# EasyEDA Pro project ESP32-DevKitC(立创EDA专业版导入可直接打样).epro

# Schematic SCH_ESP32
Create Date: 2023-04-07; Page Name: P1; Project Name: RY-ESP32-DevKitC; Schematic Name: SCH_ESP32; Update Date: 2023-05-24; Company: https://rymcu.com; Page Size: A4; Version: V1.0
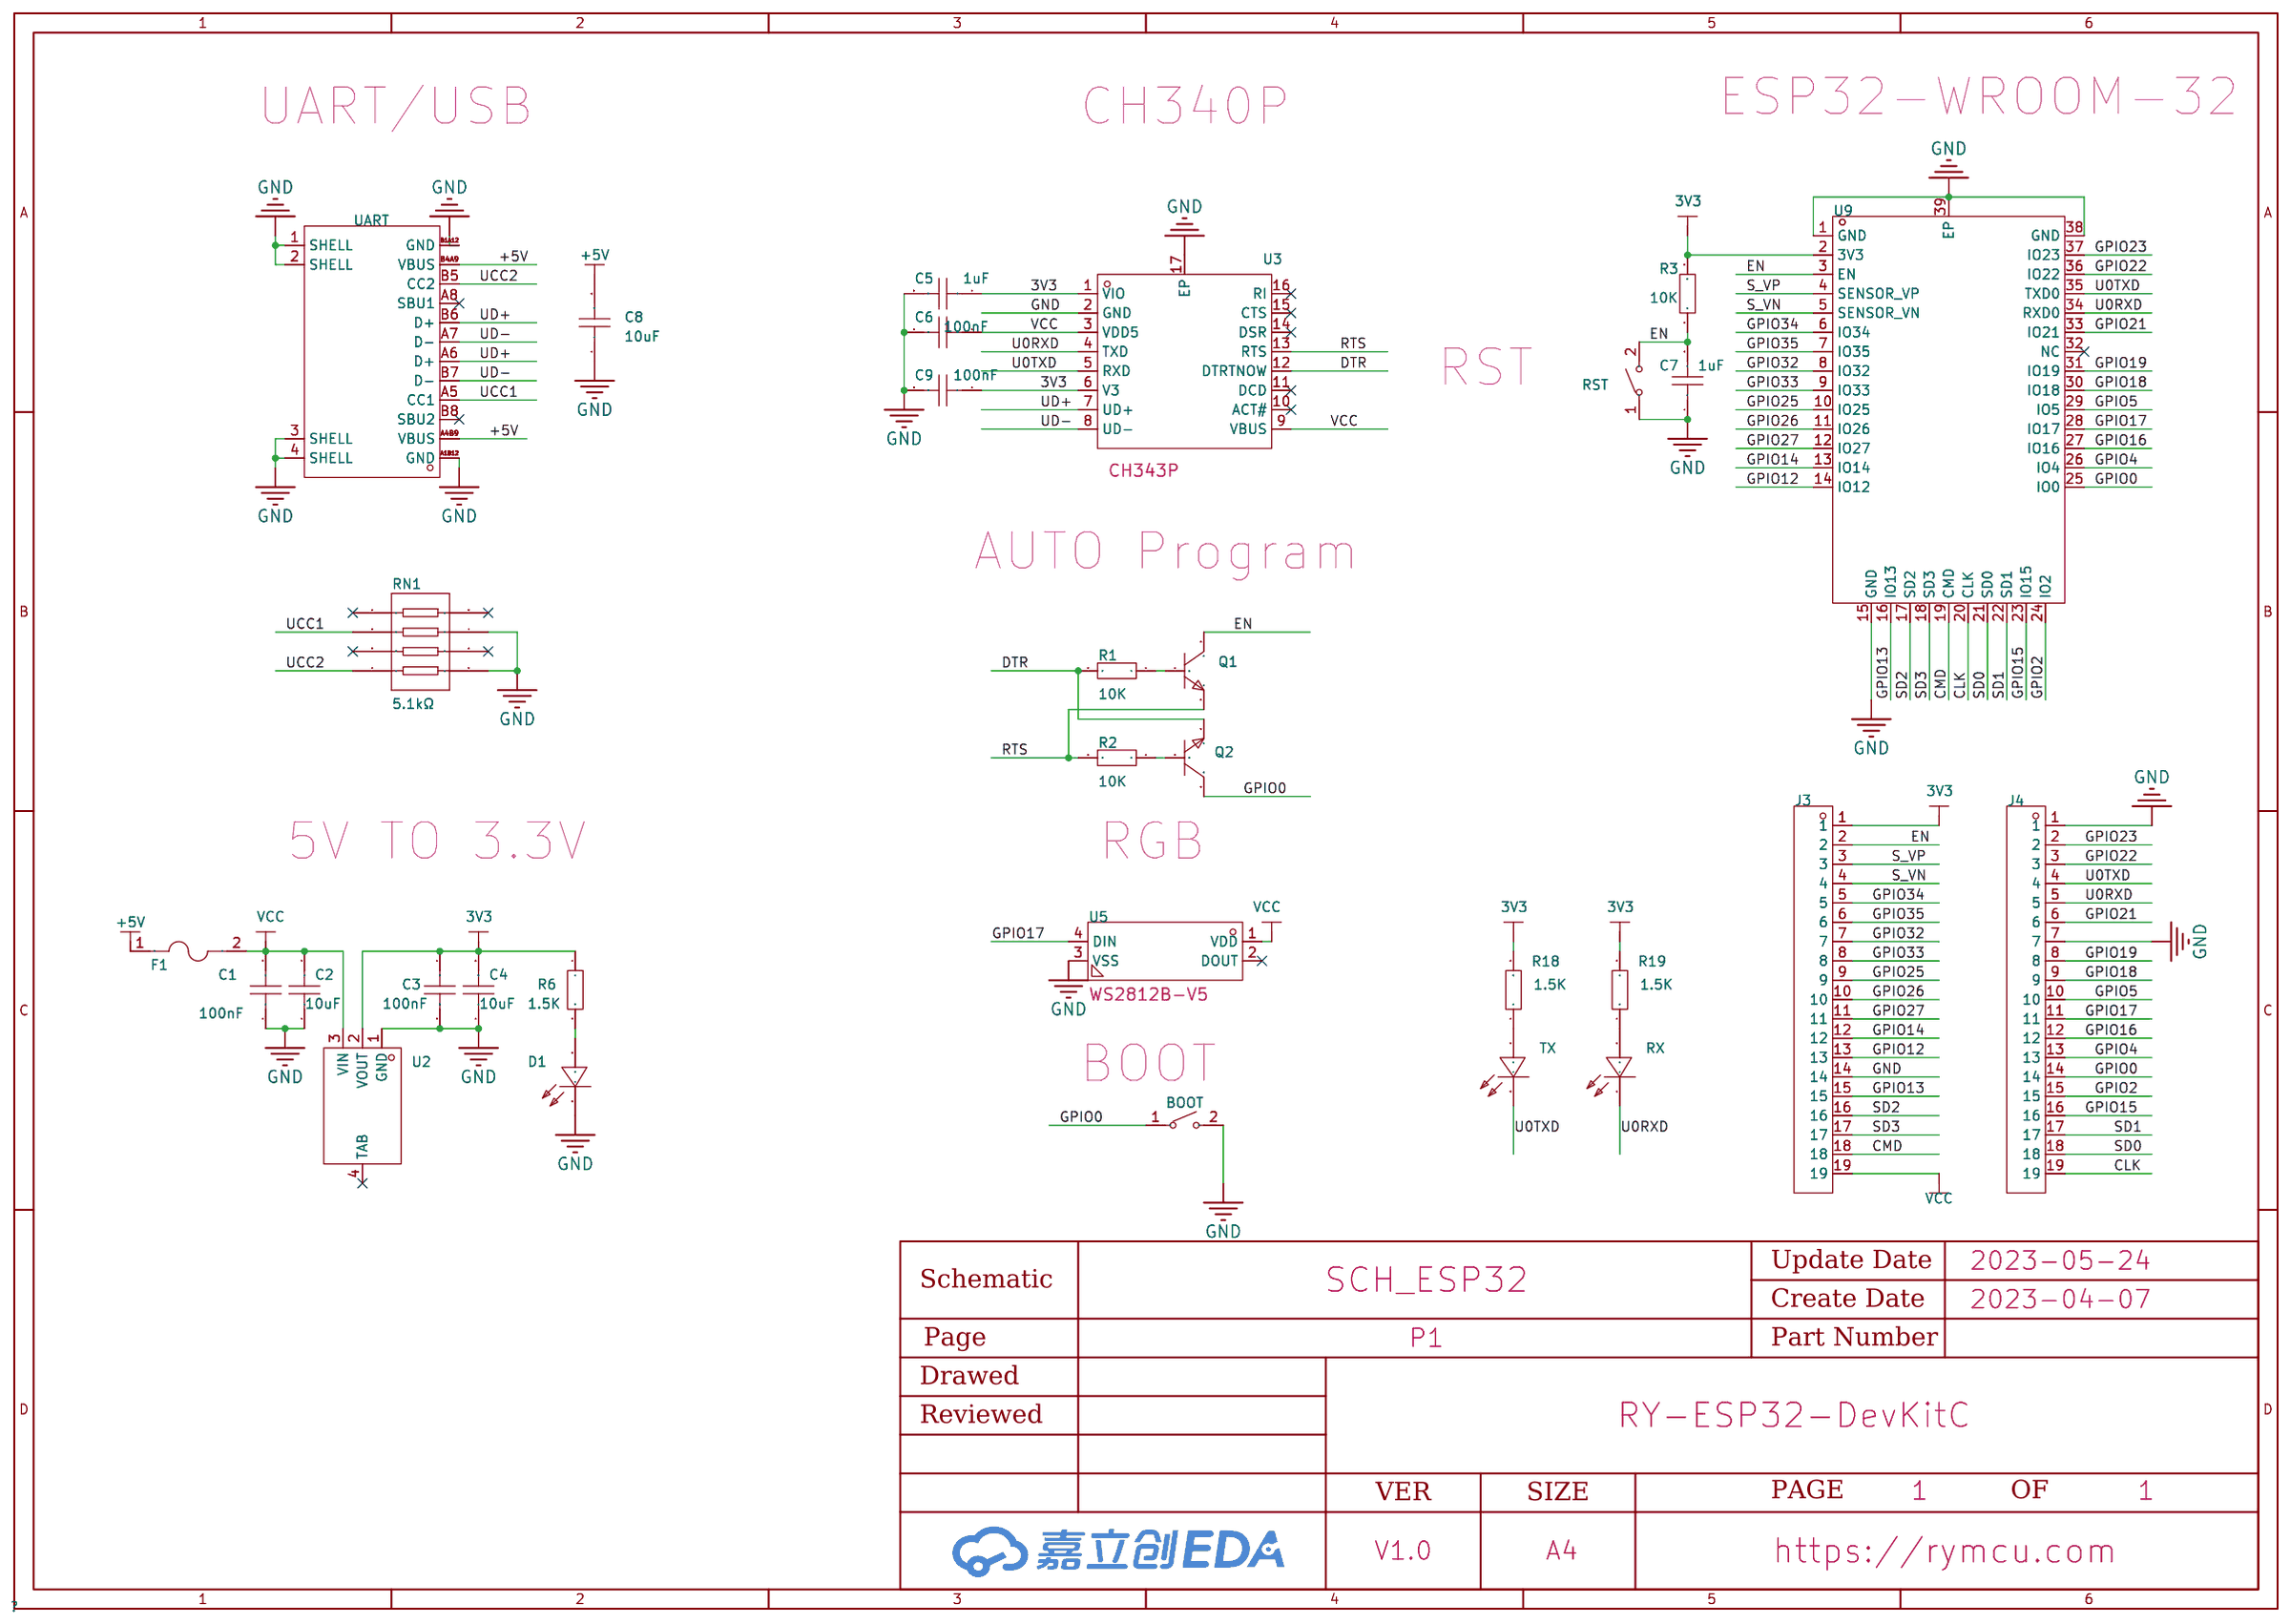
[diagram p0: schematic sheet]

## Parts
BOOT  TS-1088R-02526  [SW-SMD_L3.9-W3.0-P4.45]
C1  100nF  [C0603]
C2  10uF  [C0805]
C3  100nF  [C0603]
C4  10uF  [C0805]
C5  1uF  [C0603]
C6  100nF  [C0603]
C7  1uF  [C0603]
C8  10uF  [C0805]
C9  100nF  [C0603]
D1  NCD0603R3  [LED0603-R-RD_RED]
F1  -  [F0805]
J3  2.54-1*19P反弯针  [DIP19]
J4  2.54-1*19P反弯针  [DIP19]
Q1  L8050QLT1G  [SOT-23-3_L2.9-W1.3-P1.90-LS2.4-BR]
Q2  L8050QLT1G  [SOT-23-3_L2.9-W1.3-P1.90-LS2.4-BR]
R1  10K  [R0603]
R2  10K  [R0603]
R3  10K  [R0603]
R6  1.5K  [R0603]
R18  1.5K  [R0603]
R19  1.5K  [R0603]
RN1  5.1kΩ  [RES-ARRAY-SMD_0603-8P-L3.2-W1.6-BL]
RST  TS-1088R-02526  [SW-SMD_L3.9-W3.0-P4.45]
RX  NCD0603R3  [LED0603-R-RD_RED]
TX  NCD0603R3  [LED0603-R-RD_RED]
U2  -  [SOT-223-3_L6.5-W3.4-P2.30-LS7.0-BR]
U3  CH343P  [TQFN-16_L3.0-W3.0-P0.50-BL-EP1.7]
U5  WS2812B-V5  [LED-SMD_4P-L5.0-W5.0-TL_WS2812B-B]
U9  ESP32-WROOM-32  [WIFIM-SMD_ESP-WROOM-32]
UART  -  [USB-C-SMD_G-SWITCH_GT-USB-7010EN]

## Library data of the parts
BOOT RST = TS-1088R-02526: 触点电流:50mA;额定电压(DC):12V;电路结构:单刀单掷;安装方式:立贴;按钮形状:圆形按钮;带灯:-;开关长度:3.9mm;开关宽度:2.93mm;开关高度:2.5mm;; LCSC Part Name: 贴片无柱小龟轻触开关 260GF; Supplier Part: C455281; Manufacturer: XUNPU(讯普); Supplier Footprint: SMD,3x4x2.5mm; JLCPCB Part Class: Extended Part; Datasheet: https://atta.szlcsc.com/upload/public/pdf/source/20191118/C455281_EC5379764BC1462550DF64BBBFEA9579.pdf; Supplier: LCSC; Contact Current: 50mA; Voltage Rating (DC): 12V; Circuit: 单刀单掷; Mounting Style: 立贴; Actuator Style: 圆形按钮; Switch Length: 3.9mm; Switch Width: 2.93mm; Switch Height: 2.5mm
C1 C3 C5-C7 C9 = CC0603KRX7R9BB104: 容值:100nF;精度:±10%;额定电压:50V;材质(温度系数):X7R;; LCSC Part Name: 100nF ±10% 50V; Supplier Part: C14663; Manufacturer: YAGEO(国巨); Supplier Footprint: 0603; JLCPCB Part Class: Basic Part; Datasheet: https://atta.szlcsc.com/upload/public/pdf/source/20170116/1484561234239.pdf; Supplier: LCSC; Tolerance: ±10%; Voltage Rated: 50V; Temperature Coefficient: X7R
C2 C4 C8 = CC0805FRNPO9BN330: 容值:33pF;精度:±1pF;额定电压:50V;材质(温度系数):NP0;; LCSC Part Name: 33pF ±1pF 50V; Supplier Part: C541516; Manufacturer: YAGEO(国巨); Supplier Footprint: 0805; JLCPCB Part Class: Extended Part; Datasheet: https://atta.szlcsc.com/upload/public/pdf/source/20200615/C541516_87B4F5CEA473EFDDBB2B4786DAFFF3AA.pdf; Supplier: LCSC; Tolerance: ±1pF; Voltage Rated: 50V; Temperature Coefficient: NP0
D1 RX TX = NCD0603R3: 尺寸1.6x0.8x0.8；IF=20ma：1.6~2.6v，620~640nm,51~150mcd金线，光强高，功耗低，可靠性好，寿命长; LCSC Part Name: 红色;贴片LED;0603红灯;; Supplier Part: C3151730; Manufacturer: 国星光电; Supplier Footprint: 0603; JLCPCB Part Class: Extended Part; Datasheet: https://atta.szlcsc.com/upload/public/pdf/source/20220704/CBFF28C1847A97213A75929E60B7DDE7.pdf; Supplier: LCSC
F1 = ASMD0805-075: 最大电压:6V;最大电流:40A;保持电流:750mA;跳闸电流:1.5A;消耗功率:600mW;初始态阻值(最小值):90mΩ;跳断后阻值(最大值):385mΩ;最大动作时间:200ms;工作温度:-40~+85;; LCSC Part Name: 0.75A 自恢复; Supplier Part: C135330; Manufacturer: JDTfuse集电通; Supplier Footprint: 0805; JLCPCB Part Class: Extended Part; Datasheet: https://atta.szlcsc.com/upload/public/pdf/source/20171014/C135330_15079756464341038401.pdf; Supplier: LCSC; Operating Voltage (Max): 6V; Current Rating (Max): 40A; Hold Current: 750mA; Trip Current: 1.5A; Power Dissipation: 600mW; Resistance - Initial (Ri) (Min): 90mΩ; Resistance - Post Trip (R1) (Max): 385mΩ; Maximum Time to Trip: 200ms; Operating Temperature: -40~+85
J3 J4 = DIP19: 间距:2.54mm;总PIN位数:19;排数:1;插针结构:1x19P;行距:-;安装类型:弯插;圆针/方针:方针;额定电流:3A;额定电压:-;配合针长度:6mm;塑高:-;端接针长度:-;触头材质:黄铜;触头镀层:金;工作温度范围:-55℃~+105℃;颜色:黑色;; LCSC Part Name: 2.54mm 1x19P 弯插 方针; Supplier Part: C247840; Manufacturer: BOOMELE(博穆精密); Supplier Footprint: 插件,P=2.54mm; JLCPCB Part Class: 扩展库; Datasheet: https://atta.szlcsc.com/upload/public/pdf/source/20190322/C247840_B568C66E1694212B25CC3EB4B4A6845C.pdf; Supplier: LCSC; Pitch: 2.54mm; Number of Pins: 19; Number of Rows: 1; Pin Structure: 1x19P; Mounting Type: 弯插; Circluar Pins/Square Pins: 方针; Current Rating (Max): 3A; Length of Mating Pin: 6mm; Contact Material: 黄铜; Contact Plating: 金; Operating Temperature Range: -55℃~+105℃; Color: 黑色
Q1 Q2 = L8050QLT1G: 集电极电流(Ic):800mA;集射极击穿电压(Vceo):25V;功率(Pd):225mW;晶体管类型:NPN;; Supplier Part: C49581; Manufacturer: LRC(乐山无线电); Supplier Footprint: SOT-23(SOT-23-3); JLCPCB Part Class: 扩展库; Datasheet: https://atta.szlcsc.com/upload/public/pdf/source/20150518/1457707314424.pdf; Supplier: LCSC; Collector Current (Ic): 800mA; Collector-Emitter Breakdown Voltage (Vceo): 25V; Power Dissipation (Pd): 225mW; Transistor Type: NPN
R1-R3 R6 R18 R19 = TR0603B10K0P0525Z: 电阻类型:薄膜电阻;阻值:10kΩ;精度:±0.1%;功率:100mW;温度系数:±25ppm/;最大工作电压:75V;工作温度范围:-55~+155;; LCSC Part Name: 10kΩ ±0.1% 100mW; Supplier Part: C188363; Manufacturer: EVER OHMS(天二科技); Supplier Footprint: 0603; JLCPCB Part Class: Extended Part; Datasheet: https://atta.szlcsc.com/upload/public/pdf/source/20190415/C188363_433BF05B6FB8F7A0F5F35A3E4390C55A.pdf; Supplier: LCSC; Type: 薄膜电阻; Tolerance: ±0.1%; Power(Watts): 100mW; Temperature Coefficient: ±25ppm/; Overload Voltage (Max): 75V; Operating Temperature Range: -55~+155
RN1 = 4D03WGJ0512T5E: 阻值:5.1kΩ;精度:±5%;单个元件功率:62.5mW;温度系数:±200ppm/;电阻器数:4;引脚数:8;; LCSC Part Name: 5.1kΩ ±5% 0603x4; Supplier Part: C12028; Manufacturer: UNI-ROYAL(厚声); Supplier Footprint: 0603x4; JLCPCB Part Class: Extended Part; Datasheet: https://atta.szlcsc.com/upload/public/pdf/source/20170615/1497510926628.pdf; Supplier: LCSC; Tolerance: ±5%; Power(Watts): 62.5mW; Temperature Coefficient: ±200ppm/; Number of Resistors: 4; Number of Pins: 8
U2 = AMS1117-3.3: 输出类型:固定;输出极性:正;输出通道数:1;最大输入电压:18V;输出电压:3.3V;压差:1.4V@(1A);输出电流:800mA;电源纹波抑制比(PRSS):-;; LCSC Part Name: Vin=18V Vout=3.3V 800mA; Supplier Part: C351784; Manufacturer: PUOLOP(迪浦); Supplier Footprint: SOT-223; JLCPCB Part Class: Extended Part; Datasheet: https://atta.szlcsc.com/upload/public/pdf/source/20210915/EA806799CEEC3F52E0A4FA8303A508AC.pdf; Supplier: LCSC; Output Type: 固定; Output Polarity: 正; Number of Outputs: 1; Maximum Input Voltage: 18V; Output Voltage: 3.3V; Dropout Voltage: 1.4V@(1A); Output Current: 800mA
U3 = CH343P: 类型:-;协议类别:-;驱动器/接收器数:-;数据速率:-;; Supplier Part: C2846043; Manufacturer: WCH(南京沁恒); Supplier Footprint: QFN-16; JLCPCB Part Class: 扩展库; Datasheet: https://atta.szlcsc.com/upload/public/pdf/source/20211010/C2846043_7FA705E1F14A2906F6A2AFA45FA28209.pdf; Supplier: LCSC
U5 = WS2812B-V5: Supplier Part: C691873; Supplier Footprint: SMD,5x5mm; Supplier: LCSC
U9 = ESP32-WROOM-32: WiFi+双模蓝牙 双核CPU 网口 顶配MCU 低功耗蓝牙 ESP32系列ESP-WROOM-32模组/ESP-32S 4MB; Supplier Part: C95209; Manufacturer: ESPRESSIF(乐鑫); JLCPCB Part Class: 扩展库; Datasheet: https://atta.szlcsc.com/upload/public/pdf/source/20170925/C95209_1506321763821990573.pdf; Supplier: LCSC
UART = HC-TYPE-C-16P-01A-R: 连接器类型:Type-C;公母:母座;触点数量:16;端口数量:1;安装方式:卧贴;; LCSC Part Name: Type-C 母座 卧贴; Supplier Part: C2997433; Manufacturer: HCTL(华灿天禄); Supplier Footprint: SMD; Datasheet: https://atta.szlcsc.com/upload/public/pdf/source/20220415/23B51DCADC5F28223C40C3605487ACA1.pdf; Supplier: LCSC; Connector Type: Type-C; Gender: 母座; Number of Contacts: 16; Number of Ports: 1; Mounting Style: 卧贴

## Nets
3V3: C3.1 C4.2 C5.1 C9.1 J3.1 R3.2 R6.1 R18.2 R19.2 U2.2(VOUT) U3.1(VIO) U3.6(V3) U9.2(3V3)
+5V: C8.2 F1.1 UART.A4B9(VBUS) UART.B4A9(VBUS)
GND: BOOT.2 C1.1 C2.1 C3.2 C4.1 C5.2 C6.2 C7.1 C8.1 C9.2 D1.2(K) J3.14 J4.1 J4.7 RN1.5 RN1.7 RST.1 U2.1(GND) U3.2(GND) U3.17(EP) U5.3(VSS) U9.1(GND) U9.15(GND) U9.38(GND) U9.39(EP) UART.1(SHELL) UART.2(SHELL) UART.3(SHELL) UART.4(SHELL) UART.A1B12(GND) UART.B1A12(GND)
VCC: C1.2 C2.2 C6.1 F1.2 J3.19 U2.3(VIN) U3.3(VDD5) U3.9(VBUS) U5.1(VDD)
CLK: J4.19 U9.20(CLK)
CMD: J3.18 U9.19(CMD)
DTR: Q2.2(E) R1.2 U3.12(DTRTNOW)
EN: C7.2 J3.2 Q1.3(C) R3.1 RST.2 U9.3(EN)
GPIO0: BOOT.1 J4.14 Q2.3(C) U9.25(IO0)
GPIO2: J4.15 U9.24(IO2)
GPIO4: J4.13 U9.26(IO4)
GPIO5: J4.10 U9.29(IO5)
GPIO12: J3.13 U9.14(IO12)
GPIO13: J3.15 U9.16(IO13)
GPIO14: J3.12 U9.13(IO14)
GPIO15: J4.16 U9.23(IO15)
GPIO16: J4.12 U9.27(IO16)
GPIO17: J4.11 U5.4(DIN) U9.28(IO17)
GPIO18: J4.9 U9.30(IO18)
GPIO19: J4.8 U9.31(IO19)
GPIO21: J4.6 U9.33(IO21)
GPIO22: J4.3 U9.36(IO22)
GPIO23: J4.2 U9.37(IO23)
GPIO25: J3.9 U9.10(IO25)
GPIO26: J3.10 U9.11(IO26)
GPIO27: J3.11 U9.12(IO27)
GPIO32: J3.7 U9.8(IO32)
GPIO33: J3.8 U9.9(IO33)
GPIO34: J3.5 U9.6(IO34)
GPIO35: J3.6 U9.7(IO35)
RTS: Q1.2(E) R2.2 U3.13(RTS)
S_VN: J3.4 U9.5(SENSOR_VN)
S_VP: J3.3 U9.4(SENSOR_VP)
SD0: J4.18 U9.21(SD0)
SD1: J4.17 U9.22(SD1)
SD2: J3.16 U9.17(SD2)
SD3: J3.17 U9.18(SD3)
U0RXD: J4.5 RX.2(K) U3.4(TXD) U9.34(RXD0)
U0TXD: J4.4 TX.2(K) U3.5(RXD) U9.35(TXD0)
UCC1: RN1.2 UART.A5(CC1)
UCC2: RN1.4 UART.B5(CC2)
UD+: U3.7(UD+) UART.A6(D+) UART.B6(D+)
UD-: U3.8(UD-) UART.A7(D-) UART.B7(D-)
$3N22002: D1.1(A) R6.2
$3N24719: R18.1 TX.1(A)
$3N24720: R19.1 RX.1(A)
$3N104717: Q1.1(B) R1.1
$3N104801: Q2.1(B) R2.1

Not connected (* = marked no-connect by the designer): RN1 1* 3* 6* 8*; U2 4(TAB)*; U3 10(ACT#)* 11(DCD)* 14(DSR)* 15(CTS)* 16(RI)*; U5 2(DOUT)*; U9 32(NC)*; UART A8(SBU1)* B8(SBU2)*

## Notes on the sheet
- UART/USB
- CH340P
- ESP32-WROOM-32
- RST
- AUTO Program
- 5V TO 3.3V
- RGB
- BOOT

# Board PCB_ESP32
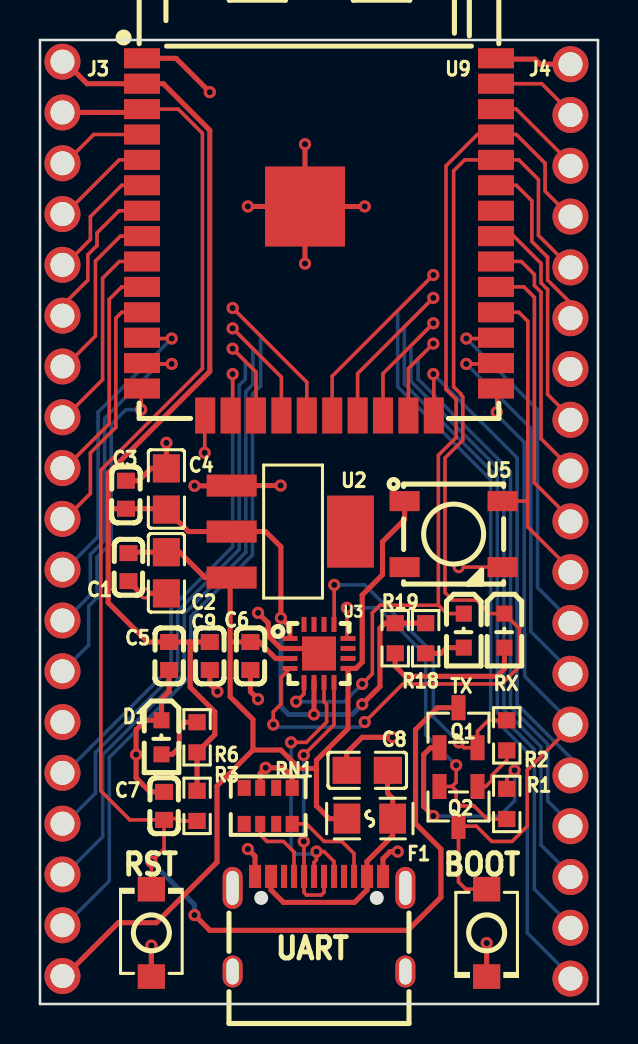
[diagram p1: board, top side]
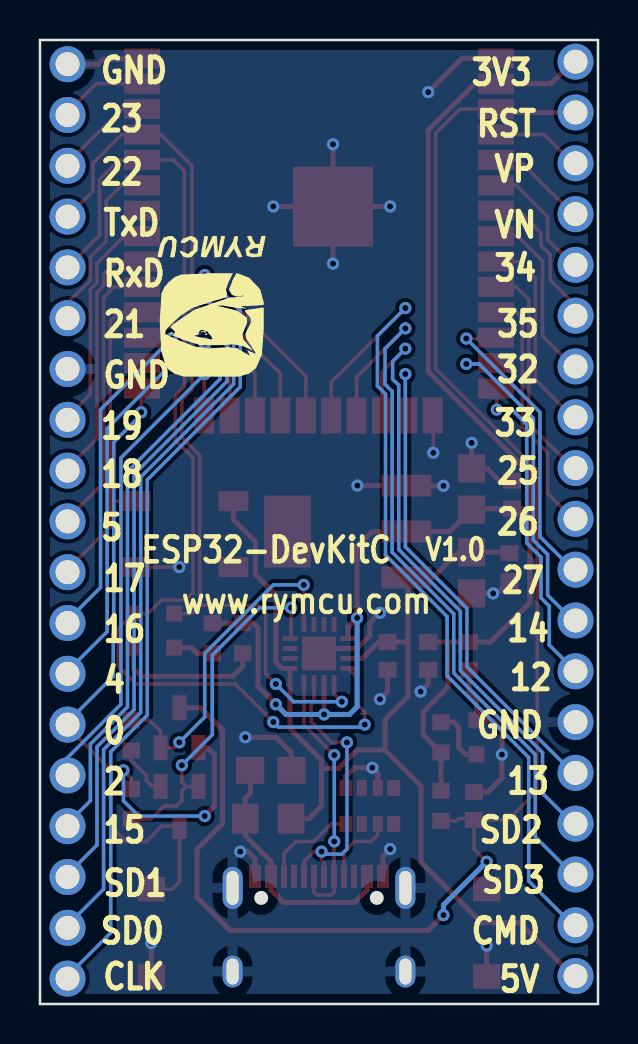
[diagram p2: board, bottom side, seen from below]

Outline 27.9 x 48.2 mm; copper layers: Top Layer, Bottom Layer. Coordinates in mm from the lower left corner of the outline.
Outline path: 0,48.2 0,0 27.9,0 27.9,48.2 0,48.2
Stack: Top Layer 0.035mm / Dielectric1 1.51mm FR4 er 4.5 / Bottom Layer 0.035mm

## Design rules (mm)
spacing safeClearance (default): track to track 0.152, other pairs 0.152 to 0.3
track width trackWidth (default): min 0.127, default 0.254, max 2.54
differential pair differentialPair (default): width min 0.127, default 0.254, max 2.54; gap min 0.152, default 0.152
via viaSize (default): diameter min 0.5, default 0.61, max 10; hole min 0.3, default 0.305, max 6

## Placement (name value [footprint] x y rotation side)
BOOT  TS-1088R-02526  [SW-SMD_L3.9-W3.0-P4.45]  22.33 3.56 270 top
C1  100nF  [C0603]  4.43 21.84 90 top
C2  10uF  [C0805]  6.32 21.56 90 top
C3  100nF  [C0603]  4.3 25.46 90 top
C4  10uF  [C0805]  6.32 25.75 270 top
C5  1uF  [C0603]  6.46 17.4 270 top
C6  100nF  [C0603]  10.52 17.4 270 top
C7  1uF  [C0603]  6.2 9.91 270 top
C8  10uF  [C0805]  16.36 11.68 0 top
C9  100nF  [C0603]  8.49 17.4 270 top
D1  NCD0603R3  [LED0603-R-RD_RED]  6.08 13.33 270 top
F1  -  [F0805]  16.49 9.27 180 top
J3  2.54-1*19P反弯针  [DIP19]  1.25 24.26 270 top
J4  2.54-1*19P反弯针  [DIP19]  26.65 24.13 270 top
Q1  L8050QLT1G  [SOT-23-3_L2.9-W1.3-P1.90-LS2.4-BR]  20.93 13.81 270 top
Q2  L8050QLT1G  [SOT-23-3_L2.9-W1.3-P1.90-LS2.4-BR]  20.93 9.88 90 top
R1  10K  [R0603]  23.34 10 270 top
R2  10K  [R0603]  23.34 13.43 90 top
R3  10K  [R0603]  7.85 9.91 90 top
R6  1.5K  [R0603]  7.85 13.33 90 top
R18  1.5K  [R0603]  19.28 18.29 90 top
R19  1.5K  [R0603]  17.76 18.29 90 top
RN1  5.1kΩ  [RES-ARRAY-SMD_0603-8P-L3.2-W1.6-BL]  11.41 9.91 0 top
RST  TS-1088R-02526  [SW-SMD_L3.9-W3.0-P4.45]  5.57 3.56 90 top
RX  NCD0603R3  [LED0603-R-RD_RED]  23.22 18.67 270 top
TX  NCD0603R3  [LED0603-R-RD_RED]  21.19 18.67 270 top
U2  -  [SOT-223-3_L6.5-W3.4-P2.30-LS7.0-BR]  12.55 23.62 180 top
U3  CH343P  [TQFN-16_L3.0-W3.0-P0.50-BL-EP1.7]  13.95 17.53 270 top
U5  WS2812B-V5  [LED-SMD_4P-L5.0-W5.0-TL_WS2812B-B]  20.68 23.49 0 top
U9  ESP32-WROOM-32  [WIFIM-SMD_ESP-WROOM-32]  13.95 38.35 0 top
UART  -  [USB-C-SMD_G-SWITCH_GT-USB-7010EN]  13.95 4 0 top

## Footprints (pads in the part's own frame, mm; a bottom-side part is the same pattern mirrored in y, then rotated)
C0603
  rect 0.8x0.9 smd: 1(-0.7,0) 2(0.7,0)
C0805
  rect 1.41x1.35 smd: 1(-1.03,0) 2(1.03,0)
DIP19
  round 1.8 hole 1.2: 1(-22.86,-0.127) 2(-20.32,-0.127) 3(-17.78,-0.127) 4(-15.24,-0.127) 5(-12.7,-0.127) 6(-10.16,-0.127) 7(-7.62,-0.127) 8(-5.08,-0.127) 9(-2.54,-0.127) 10(0,-0.127) 11(2.54,-0.127) 12(5.08,-0.127) 13(7.62,-0.127) 14(10.16,-0.127) 15(12.7,-0.127) 16(15.24,-0.127) 17(17.78,-0.127) 18(20.32,-0.127) 19(22.86,-0.127)
F0805
  rect 1.335x1.5 smd: 1(-1.143,0) 2(1.143,0)
LED0603-R-RD_RED
  rect 0.8x0.8 smd: 1(0.851,0) 2(-0.851,0)
LED-SMD_4P-L5.0-W5.0-TL_WS2812B-B
  rect 1.5x1 smd: 1(-2.45,1.65) 2(-2.45,-1.65) 3(2.45,-1.65) 4(2.45,1.65)
R0603
  rect 0.806x0.864 smd: 1(-0.753,0) 2(0.753,0)
RES-ARRAY-SMD_0603-8P-L3.2-W1.6-BL
  rect 0.65x0.8 smd: 1(-1.2,-0.9) 4(1.2,-0.9) 5(1.2,0.9) 8(-1.2,0.9)
  rect 0.5x0.8 smd: 2(-0.4,-0.9) 3(0.4,-0.9) 6(0.4,0.9) 7(-0.4,0.9)
SOT-23-3_L2.9-W1.3-P1.90-LS2.4-BR
  rect 1.25x0.7 smd: 1(1,-0.95) 2(1,0.95) 3(-1,0)
SOT-223-3_L6.5-W3.4-P2.30-LS7.0-BR
  rect 2.5x1.1 smd: 1(2.97,-2.3) 2(2.97,0) 3(2.97,2.3)
  rect 2.34x3.6 smd: 4(-2.97,0)
SW-SMD_L3.9-W3.0-P4.45
  rect 1.23x1.36 smd: 1(-2.185,0) 2(2.185,0)
TQFN-16_L3.0-W3.0-P0.50-BL-EP1.7
  rect 0.25x0.75 smd: 1(-0.749,-1.45) 2(-0.248,-1.45) 3(0.252,-1.45) 4(0.751,-1.45) 9(0.75,1.45) 10(0.25,1.45) 11(-0.25,1.45) 12(-0.749,1.45)
  rect 0.75x0.25 smd: 5(1.45,-0.75) 6(1.45,-0.25) 7(1.45,0.25) 8(1.45,0.75) 13(-1.45,0.75) 14(-1.45,0.25) 15(-1.45,-0.25) 16(-1.45,-0.75)
  rect 1.7x1.7 smd: 17(0.001,0)
USB-C-SMD_G-SWITCH_GT-USB-7010EN
  oval 1x2.1 hole 0.6x1.7: 1(-4.32,1.802) 2(4.32,1.802)
  oval 1x1.6 hole 0.6x1.3: 3(4.32,-2.377) 4(-4.32,-2.377)
  rect 0.6x1.15 smd: A1B12(-3.2,2.377) A4B9(-2.4,2.377) B1A12(3.2,2.377) B4A9(2.4,2.377)
  rect 0.3x1.15 smd: A5(-1.25,2.377) A6(-0.25,2.377) A7(0.25,2.377) A8(1.25,2.377) B5(1.75,2.377) B6(0.75,2.377) B7(-0.75,2.377) B8(-1.75,2.377)
WIFIM-SMD_ESP-WROOM-32
  rect 1.8x1.001 smd: 1(-8.851,8.931) 2(-8.851,7.66) 3(-8.851,6.391) 4(-8.851,5.12) 5(-8.851,3.85) 6(-8.851,2.58) 7(-8.851,1.31) 8(-8.851,0.041) 9(-8.851,-1.23) 10(-8.851,-2.499) 11(-8.851,-3.769) 12(-8.851,-5.04) 13(-8.851,-6.309) 14(-8.851,-7.58) 25(8.851,-7.58) 26(8.851,-6.309) 27(8.851,-5.04) 28(8.851,-3.769) 29(8.851,-2.499) 30(8.851,-1.23) 31(8.851,0.041) 32(8.851,1.31) 33(8.851,2.58) 34(8.851,3.85) 35(8.851,5.12) 36(8.851,6.391) 37(8.851,7.66) 38(8.851,8.931)
  rect 1.001x1.8 smd: 15(-5.689,-8.931) 16(-4.42,-8.931) 17(-3.15,-8.931) 18(-1.879,-8.931) 19(-0.61,-8.931) 20(0.66,-8.931) 21(1.931,-8.931) 22(3.2,-8.931) 23(4.471,-8.931) 24(5.74,-8.931)
  rect 4x4 smd: 39(-0.7,1.52)

## Nets
As in the schematic.

Pads without a net: RN1 1 3 6 8; U2 4; U3 10 11 14 15 16; U5 2; U9 32; UART A8 B8

## Via types
v1: diameter 0.61, hole 0.305, Top Layer to Bottom Layer, 55 vias

## Routing (per net, layer and track width the routed paths; a pad name or vN(x,y) marks a point on that pad's centre or on a via; arc(x,y) is an arc through that point)
3V3: length 79.8
  Top Layer w0.254: v1(13.7,14.48) 13.7,14.48 U3.6 ; C9.1 7.51,18.1 ; 7.51,18.1 C5.1 5.38,18.1 3.41,20.07 3.41,24.77 ; 7.51,18.1 7.51,15.84 8.74,14.6 8.74,13.47 R6.1 R3.2 ; R18.2 R19.2 17.25,19.04 17,18.79 17,15.88 v1(16.11,14.99) ; 3.41,24.77 C3.1 6.28,24.77 C4.2 7.42,23.62 U2.2 11.28,23.62 12.05,22.86 v1(12.05,19.3) 12.5,18.85 U3.1 ; 3.41,24.77 3.41,26.54 8.49,31.62 8.49,43.69 6.16,46.01 U9.2 2.35,46.01 1.25,47.12
  Bottom Layer w0.254: v1(12.05,19.3) 12.05,14.86 12.43,14.48 v1(13.7,14.48) 15.6,14.48 v1(16.11,14.99)
+5V: length 12.6
  Top Layer w0.254: C8.2 17.38,11.67 17.38,10.54 17.63,10.29 F1.1 17.63,8.41 16.35,7.13 UART.B4A9 16.35,5.7 15.73,5.08 12.17,5.08 11.55,5.7 UART.A4B9
GND: length 62.5
  Top Layer w0.178: 23.13,21.84 v1(20.94,21.84) ; U9.15 8.24,29.4 v1(8.24,27.56)
  Top Layer w0.254: v1(7.73,25.91) 9.57,25.91 U2.1 v1(12.03,25.92) ; UART.A1B12 10.75,7.39 v1(10.39,7.75) ; C5.2 6.46,15.62 6.08,15.24 D1.2 5.28,14.19 4.81,13.72 v1(4.81,12.47) 4.81,11.3 5.5,10.61 C7.1 ; BOOT.2 v1(22.33,3.05) ; v1(16.24,39.88) 16.23,39.87 U9.39 ; v1(10.39,39.88) 13.25,39.88 U9.39 ; v1(8.49,45.59) 6.8,47.28 U9.1 ; C3.2 4.94,26.16 5.55,26.78 C4.1 v1(6.32,28.06) ; v1(17.63,13.33) 16.11,13.33 15.33,12.56 C8.1 ; U3.17 13.7,17.77 U3.2 12.05,17.77 11.41,18.41 11.41,19.05 v1(10.9,19.56) ; RN1.7 11.01,11.54 v1(11.28,11.81) 12.17,11.81 12.61,11.37 RN1.5 ; U9.39 v1(13.25,42.99) ; U9.39 v1(13.25,37.02) ; RST.1 v1(5.57,2.92) ; C6.2 10.52,15.62 v1(10.9,15.24) ; UART.B1A12 17.15,7.26 17.51,7.62 v1(17.89,7.62) ; C1.1 5.04,20.53 C2.1 ; U9.38 22.84,47.24 24.75,47.24 25,46.99 26.65,46.99 ; C9.2 8.49,16 v1(8.87,15.62)
  vias: v1(5.24,20.53)
VCC: length 57
  Top Layer w0.254: C1.2 4.47,22.59 C2.2 6.98,22.59 8.25,21.32 U2.3 9.5,21.24 9.5,15.37 10.65,14.22 10.65,12.7 ; 18.23,25.14 18.23,24.22 17.12,23.11 17.12,21.46 16.11,20.45 16.11,17.09 15.8,16.78 U3.9 15.4,13.77 13.82,12.19 13.82,11.78 ; 10.65,12.7 12.05,12.7 12.97,11.78 13.82,11.78 ; 10.65,12.7 8.85,10.9 8.85,7.09 5.82,4.06 3.92,4.06 1.25,1.4 ; F1.2 14.46,9.27 13.82,9.91 13.82,11.78 ; U3.3 11.79,17.27 10.96,18.1 C6.1 9.59,18.1
CLK: length 48.7
  Top Layer w0.178: U9.20 14.61,31.39 v1(19.66,36.45)
  Bottom Layer w0.178: v1(19.66,36.45) 17.89,34.67 17.89,30.86 22.53,26.21 22.53,14.44 24.36,12.61 24.36,3.56 26.65,1.27
CMD: length 42.4
  Top Layer w0.178: U9.19 13.34,31.09 v1(9.63,34.8)
  Bottom Layer w0.178: 1.25,3.94 3.46,6.15 3.46,12.33 7.54,16.41 7.54,19.37 10.62,22.45 10.62,30.5 11.03,30.9 11.03,33.4 v1(9.63,34.8)
DTR: length 18.1
  Top Layer w0.178: U3.12 15.35,18.33 v1(15.35,19.81) ; 20.6,10.88 19.97,10.88 ; 20.6,10.88 20.81,10.67 20.81,10.16 21.06,9.91 21.7,9.91 22.35,9.25 R1.2 ; 20.6,10.88 20.81,11.08 v1(20.81,11.94)
  Bottom Layer w0.178: v1(20.81,11.94) 19.28,13.46 19.28,17.44 16.91,19.81 v1(15.35,19.81)
EN: length 80
  Top Layer w0.178: R3.1 7.08,9.15 6.97,9.27 6.27,9.27 C7.2 ; C7.2 4.49,9.21 3.04,10.66 3.04,26.7 8.12,31.78 8.12,43.54 6.91,44.74 U9.3 ; C7.2 6.2,7.75 v1(5.57,7.11) RST.2
  Top Layer w0.254: v1(7.73,4.44) 8.49,3.68 18.4,3.68 20.05,5.33 20.05,7.75 18.78,9.02 18.78,13.72 19.87,14.81 Q1.3 ; U9.3 4.93,44.58 1.25,44.58
  Bottom Layer w0.254: v1(5.57,7.11) 7.73,4.95 v1(7.73,4.44)
GPIO0: length 32.9
  Top Layer w0.178: 26.65,13.97 24.36,11.68 24.36,8.89 23.6,8.13 22.59,8.13 21.82,8.89 20.94,8.89 Q2.3 20.93,6.11 21.29,5.74 BOOT.1 ; v1(22.84,29.59) 22.84,30.73 U9.25
  Bottom Layer w0.178: 26.65,13.97 24.24,16.38 24.24,18.49 24.21,18.48 24.21,28.09 22.84,29.46 v1(22.84,29.59)
GPIO2: length 25
  Top Layer w0.178: U9.24 19.69,31.47
  Bottom Layer w0.178: 26.65,11.43 26.65,12.19 23.86,14.99 23.86,27.3 v1(19.66,31.5)
GPIO4: length 19.2
  Top Layer w0.178: U9.26 22.76,32 v1(21.32,32)
  Bottom Layer w0.178: v1(21.32,32) 24.54,28.78 24.54,18.62 26.65,16.51
GPIO5: length 14.1
  Top Layer w0.178: U9.29 24.2,35.85 24.72,35.33 24.72,26.06 26.65,24.13
GPIO12: length 16.2
  Top Layer w0.178: U9.14 5.06,30.73 v1(5.06,29.72)
  Bottom Layer w0.178: v1(5.06,29.72) 4.3,29.72 3.56,28.98 3.56,23.05 2.85,22.34 2.85,20.31 2.44,19.9 2.44,17.95 1.25,16.76 1.25,16.64
GPIO13: length 25.5
  Top Layer w0.178: U9.16 9.63,29.52 v1(9.63,31.5)
  Bottom Layer w0.178: 1.25,11.56 6.55,16.86 6.55,19.78 9.63,22.86 v1(9.63,31.5)
GPIO14: length 16.9
  Top Layer w0.178: U9.13 5.14,32 v1(6.58,32)
  Bottom Layer w0.178: 1.25,19.18 2.52,20.45 2.52,22.48 3.23,23.19 3.23,29.29 5.95,32 v1(6.58,32)
GPIO15: length 31.8
  Top Layer w0.178: v1(19.66,33.02) 18.42,31.78 U9.23
  Bottom Layer w0.178: 26.65,8.89 25.38,10.16 25.38,12.99 23.53,14.85 23.53,26.62 18.9,31.24 18.9,32.26 v1(19.66,33.02)
GPIO16: length 17.9
  Top Layer w0.178: U9.27 22.76,33.27 v1(21.32,33.27)
  Bottom Layer w0.178: v1(21.32,33.27) 24.87,29.72 24.87,20.83 26.65,19.05
GPIO17: length 16.5
  Top Layer w0.178: 26.65,21.59 24.39,23.85 24.39,34.14 23.94,34.58 U9.28 ; U5.4 24.39,25.14
GPIO18: length 12.8
  Top Layer w0.178: 26.65,26.67 25.05,28.27 25.05,35.59 24.72,35.92 24.72,36.47 24.07,37.12 U9.30
GPIO19: length 11.3
  Top Layer w0.178: U9.31 23.69,38.39 25.05,37.03 25.05,36.06 25.38,35.73 25.38,30.48 26.65,29.21
GPIO21: length 8.8
  Top Layer w0.178: 26.65,34.29 26.65,34.92 25.38,36.19 25.38,37.34 24.59,38.13 24.59,40.16 23.82,40.93 U9.33
GPIO22: length 5
  Top Layer w0.178: U9.36 23.82,44.74 26.65,41.91
GPIO23: length 4.5
  Top Layer w0.178: 26.65,44.45 25.09,46.01 U9.37
GPIO25: length 11.2
  Top Layer w0.178: U9.10 4.08,35.85 3.46,35.23 3.46,29.01 1.25,26.8
GPIO26: length 12.5
  Top Layer w0.178: 1.25,24.26 2.52,25.53 2.52,27.56 3.79,28.83 3.79,34.29 4.08,34.58 U9.11
GPIO27: length 15.3
  Top Layer w0.178: U9.12 5.14,33.27 v1(6.58,33.27)
  Bottom Layer w0.178: v1(6.58,33.27) 2.9,29.59 2.9,23.37 1.25,21.72
GPIO32: length 8.7
  Top Layer w0.178: U9.8 4.02,38.39 2.77,37.15 2.77,33.4 1.25,31.88
GPIO33: length 10
  Top Layer w0.178: 1.25,29.34 3.13,31.22 3.13,36.29 3.96,37.12 U9.9
GPIO34: length 6.2
  Top Layer w0.178: U9.6 4.08,40.93 2.52,39.37 2.52,38.23 1.25,36.96
GPIO35: length 7.5
  Top Layer w0.178: U9.7 3.96,39.66 2.85,38.56 2.85,37.92 2.39,37.46 2.39,36.19 1.25,35.05 1.25,34.42
RTS: length 16.9
  Top Layer w0.178: v1(14.71,20.95) 14.71,18.99 U3.13 ; v1(20.94,13.08) 21.2,12.81 Q1.2 21.88,13.64 22.42,14.19 R2.2
  Bottom Layer w0.178: v1(14.71,20.95) 16.24,20.95 19.66,17.53 19.66,14.35 v1(20.94,13.08)
S_VN: length 5
  Top Layer w0.178: 1.25,39.5 3.96,42.2 U9.5
S_VP: length 4.4
  Top Layer w0.178: U9.4 2.69,43.47 1.25,42.04
SD0: length 43
  Top Layer w0.178: v1(19.66,35.31) 15.88,31.52 U9.21
  Bottom Layer w0.178: 26.65,3.81 24.72,5.74 24.72,12.72 22.87,14.58 22.87,26.35 18.22,30.99 18.22,33.86 v1(19.66,35.31)
SD1: length 37.2
  Top Layer w0.178: U9.22 17.15,31.52 v1(19.66,34.04)
  Bottom Layer w0.178: v1(19.66,34.04) 18.55,32.92 18.55,31.13 23.2,26.48 23.2,14.71 25.05,12.86 25.05,7.95 26.65,6.35
SD2: length 31.6
  Top Layer w0.178: U9.17 10.8,31.6 v1(9.63,32.77)
  Bottom Layer w0.178: 1.25,9.02 2.77,10.54 2.77,12.57 6.88,16.68 6.88,19.64 9.96,22.72 9.96,30.94 10.27,31.24 10.27,32.13 v1(9.63,32.77)
SD3: length 37
  Top Layer w0.178: U9.18 12.07,31.34 v1(9.63,33.78)
  Bottom Layer w0.178: v1(9.63,33.78) 10.65,32.77 10.65,30.99 10.29,30.63 10.29,22.59 7.21,19.5 7.21,16.54 3.13,12.47 3.13,8.36 1.25,6.48
U0RXD: length 54.8
  Top Layer w0.178: 26.65,36.83 J4.5 24.92,38.43 24.92,41.22 23.94,42.2 U9.34 21.23,42.2 20.68,41.66 20.68,30.86 21.06,30.48 21.06,30.44 21.14,30.36 21.14,28.19 20.25,27.3 20.25,20.57 20.63,20.19 21.82,20.19 22.5,19.52 RX.2 23.98,18.76 23.98,16.89 23.09,16 18.14,16 v1(16.24,14.1) ; U3.4 12.05,16.32 12.05,14.99 11.66,14.6 v1(11.66,13.97)
  Bottom Layer w0.178: v1(11.66,13.97) 11.79,13.84 15.98,13.84 v1(16.24,14.1)
U0TXD: length 45.5
  Top Layer w0.178: 19.92,19.94 17,19.94 16.62,19.56 16.62,16.51 v1(16.11,16) ; 19.92,19.94 19.92,27.44 20.81,28.33 20.81,30.23 20.3,30.73 20.3,41.91 21.86,43.47 U9.35 23.82,43.47 25.25,42.04 25.25,40.64 J4.4 26.65,39.37 ; 19.92,19.94 20.34,19.52 TX.2 ; U3.5 13.2,15.51 v1(12.81,15.11)
  Bottom Layer w0.178: v1(12.81,15.11) 15.22,15.11 v1(16.11,16)
UCC1: length 3.8
  Top Layer w0.178: 11.01,9.01 11.01,8.47 11.35,8.13 12.17,8.13 12.7,7.6 UART.A5
UCC2: length 4.8
  Top Layer w0.178: 12.61,9.01 13.33,9.01 14.2,8.13 15.09,8.13 15.7,7.52 UART.B5
UD+: length 14.1
  Top Layer w0.178: U3.7 14.2,15.12 14.33,14.99 14.33,14.1 13.31,13.08 v1(12.55,13.08) ; UART.B6 14.7,7.12 14.2,7.62 v1(13.82,7.62) 13.82,7.2 13.7,7.08 UART.A6
  Bottom Layer w0.178: v1(12.55,13.08) 12.55,7.75 12.81,7.49 13.7,7.49 v1(13.82,7.62)
UD-: length 13
  Top Layer w0.178: v1(13.19,12.45) 14.7,13.96 U3.8 ; UART.A7 14.2,5.58 14.06,5.45 13.33,5.45 13.2,5.58 UART.B7 13.2,8.12 v1(13.19,8.13)
  Bottom Layer w0.178: v1(13.19,12.45) v1(13.19,8.13)
$3N22002: length 3
  Top Layer w0.254: R6.2 7.21,14.09 6.97,13.84 6.97,12.83 6.62,12.48 D1.1
$3N24719: length 2
  Top Layer w0.254: R18.1 20.05,17.53 20.34,17.82 TX.1
$3N24720: length 7.5
  Top Layer w0.254: RX.1 23.22,16.76 22.84,16.38 18.27,16.38 17.76,16.89 R19.1
$3N104717: length 11.2
  Top Layer w0.178: v1(23.73,11.68) 23.34,11.29 R1.1
  Top Layer w0.254: v1(19.66,9.4) 19.18,9.88 19.18,12.47 19.52,12.81 19.97,12.81
  Bottom Layer w0.178: v1(19.66,9.4) 22.97,9.4 23.73,10.16 v1(23.73,11.68)
$3N104801: length 2.6
  Top Layer w0.178: R2.1 23.34,12.18 22.59,11.43 22.59,11.18 22.29,10.88 Q2.1

## Copper pours and planes (outline as drawn; the poured copper is in the pictures)
GND on Bottom Layer: 0,48.2 27.9,48.2 27.9,0 0,0

## Text on the board
Bottom Silkscreen Layer: V1.0 | www.rymcu.com | ESP32-DevKitC | 12 | 14 | 13 | 27 | 5V | 35 | 32 | 25 | 26 | VP | VN | 34 | 33 | SD3 | SD2 | RST | GND | 3V3 | CMD | TxD | RxD | 21 | 17 | 16 | 4 | 0 | 2 | 15 | SD1 | CLK | 23 | 22 | 19 | 18 | 5 | SD0
